# EAGLE schematic OpticalTriggerV1 (EAGLE 9.4.2)
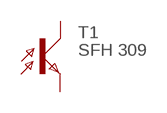
[diagram p0: schematic, sheet 1]

## Parts
T1  SFH 309  BPX81  [BPX81]
Unconnected: T1.C T1.E

## Library data of the parts
T1 = opto-trans-siemens:BPX81: PHOTO TRANSISTOR; OC_FARNELL: unknown; OC_NEWARK: unknown